# EAGLE design 555Oscillator (EAGLE 9.1.3)
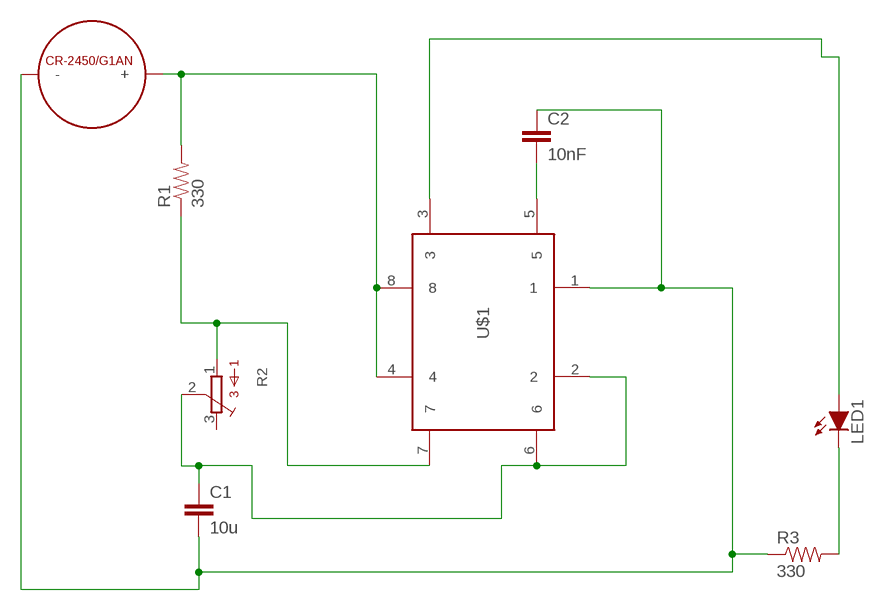
[diagram p0: schematic, sheet 1]

## Parts
C1  10u  CAP_  [AXIAL-5MM]
C2  10nF  CAP_  [AXIAL-5MM]
LED1  LED-5MM  [LED-5MM]
R1  330  RESISTORAXIAL-0.3  [AXIAL-0.3]
R2  TRIMPOT_3296C  [TRIMPOT_3296]
R3  330  RESISTORAXIAL-0.3  [AXIAL-0.3]
U$1  555_TIMER  [DIL08]
U$2  CR-2450/G1AN  [CR-2450/G1AN]

## Nets
N$2: C1.P$2 C2.P$1 R3.P$1 U$1.1 U$2.-
N$3: R1.P$1 R2.1 U$1.7
N$8: R1.P$2 U$1.4 U$1.8 U$2.+_0(+) U$2.+_1(+)
N$9: LED1.A U$1.3
N$10: LED1.K(C) R3.P$2
N$11: C2.P$2 U$1.5
N$13: C1.P$1 R2.2 U$1.2 U$1.6
Unconnected: R2.3

## Library data of the parts
C1 C2 = HyTechDevices:CAP: Capacitor Standard 0603 ceramic capacitor, and 0.1" leaded capacitor.
LED1 = HyTechDevices:LED: Light Emitting Diode (LED) Source: Dangerous Prototypes Eagle Library <https://github.com/DangerousPrototypes/Eagle_Part_Library>
R1 R3 = HyTechDevices:RESISTOR: Resistor Basic schematic elements and footprints for 0603, 1206, and PTH resistors.
R2 = HyTechDevices:TRIMPOT_3296: 3296 Series 3/8" Square Trimmer Source <https://github.com/chiengineer/Eagle-Libraries/blob/master/Potentiometers/bourns.lbr>
U$1 = HyTechDevices:555_TIMER: Standard 555 Timer Fairchild Semiconductor LM555CN Texas Instruments LM555CN/NOPB
U$2 = HyTechDevices:CR-2450/G1AN: Panasonic CR2450 Battery through hole.

## Board
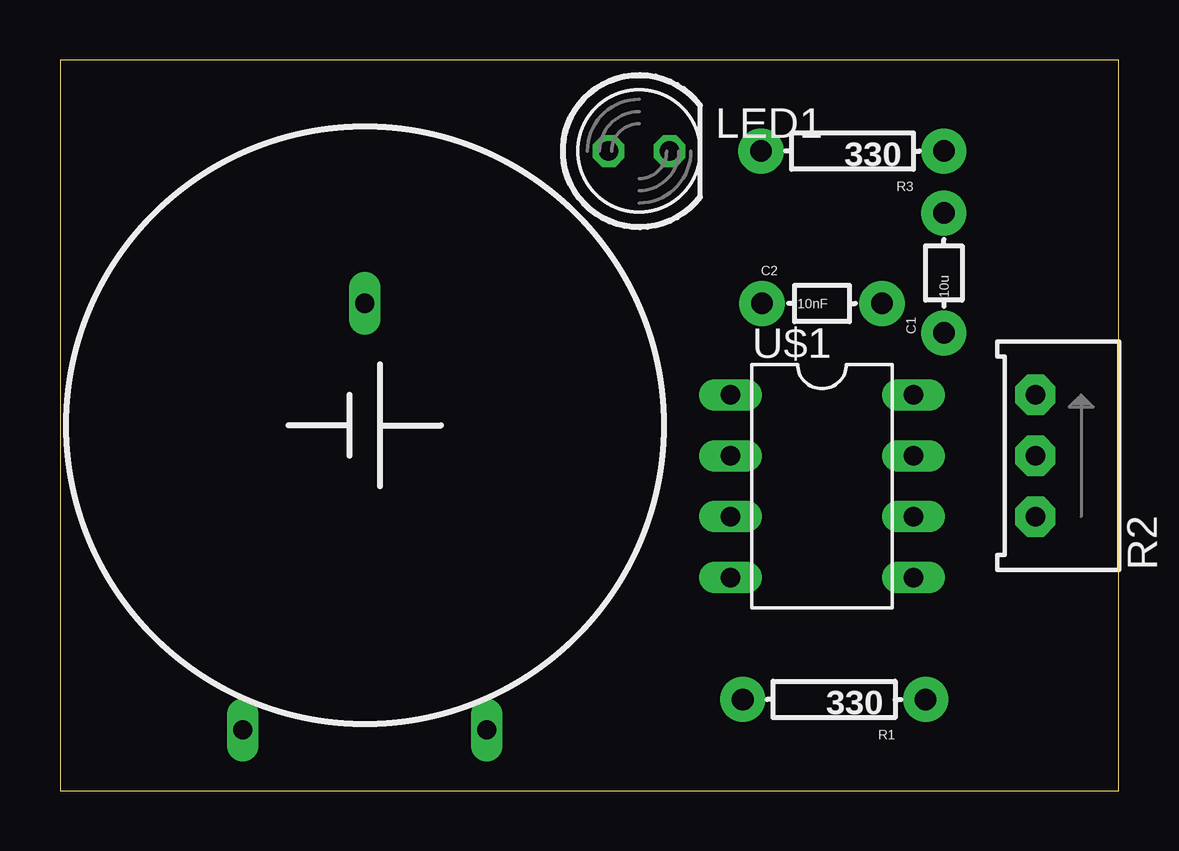
[diagram p1: board, top side]
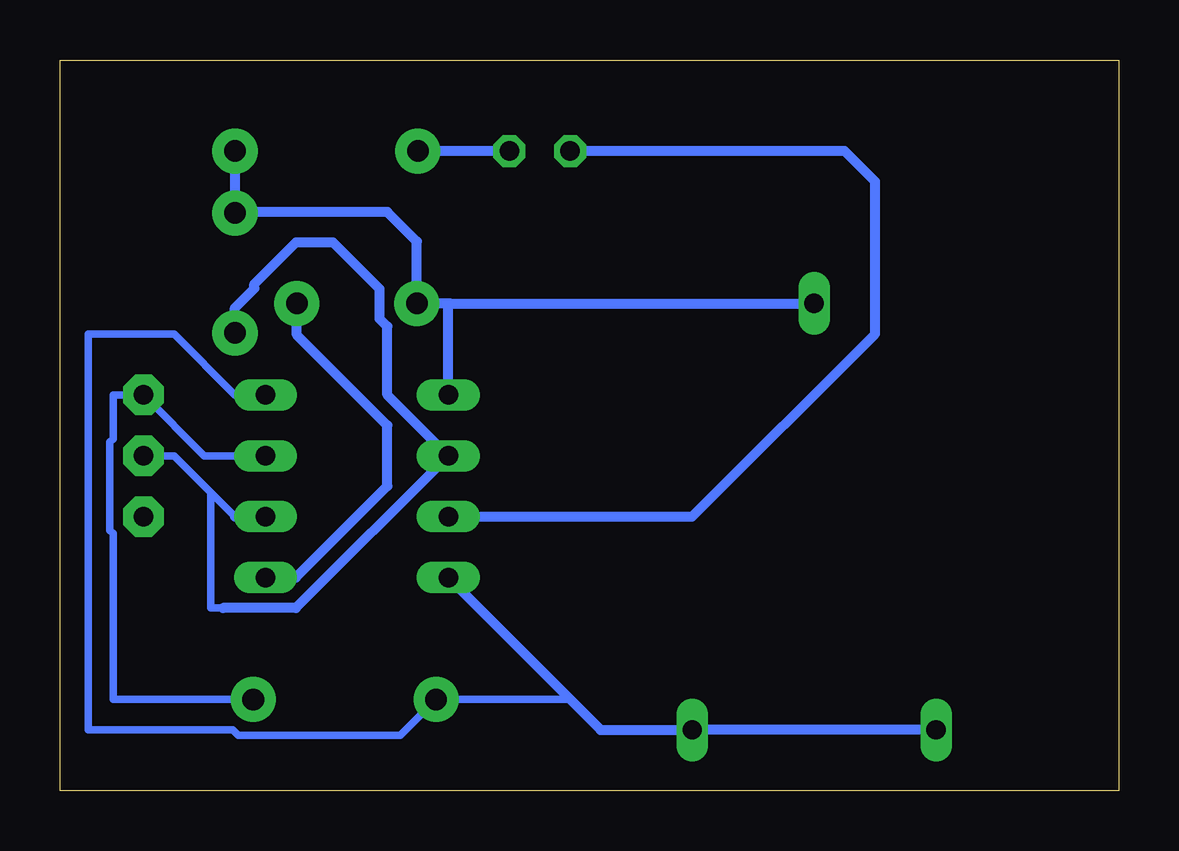
[diagram p2: board, bottom side, seen from below]

Size 44.12 x 30.47 mm. Coordinates in mm from the lower left corner, seen from the top.
Outline: 0,0 44.12,0 44.12,30.47 0,30.47 0,0
Copper layers (1*16): Top 0.035mm / dielectric 1.5mm / Bottom 0.035mm
Design rules "default *": minimum track width 6mil, minimum drill 0.35mm, track to track 16mil, track to pad 16mil, pad to pad 16mil, via to via 16mil, smd to smd 16mil, copper to edge 40mil, drill to drill 6mil, minimum pad ring 10mil, minimum via ring 8mil, stop-mask expansion 4mil, vias tented up to drill 0mil, thermal gap 10mil

### Footprints (pad centres in the part's own frame; a part is rotated, then mirrored left to right if it is on the bottom)
AXIAL-5MM = drill 0.9 pad 1.88: P$1 -2.5,0; P$2 2.5,0
LED-5MM = drill 0.813 octagon: A -1.27,0; K 1.27,0
AXIAL-0.3 = drill 0.9 pad 1.88: P$1 -3.81,0; P$2 3.81,0
TRIMPOT_3296 = drill 0.813 pad 1.676 octagon: 1 2.54,1.27; 2 0,1.27; 3 -2.54,1.27
DIL08 = drill 0.813 long: 1 -3.81,-3.81; 2 -1.27,-3.81; 3 1.27,-3.81; 4 3.81,-3.81; 5 3.81,3.81; 6 1.27,3.81; 7 -1.27,3.81; 8 -3.81,3.81
CR-2450/G1AN = drill 0.8 long: +_0 -5.08,12.7; +_1 5.08,12.7; - 0,-5.08

### Placement (x,y rotation side)
C1  36.83,21.59 90 top
C2  31.75,20.32 0 top
LED1  24.13,26.67 0 top
R1  32.26,3.81 180 top
R2  41.91,13.97 90 top
R3  33.02,26.67 180 top
U$1  31.75,12.7 270 top
U$2  12.7,15.24 180 top

### Tracks (layer width: path | path; a pad name or v marks a point on that pad's centre or on a via)
N$2
  Bottom 0.406: 27.88,20.32 U$2.- | 27.88,20.32 C2.P$1 29.25,22.9 30.48,24.13 36.79,24.13 C1.P$2 R3.P$1 | U$1.1 27.94,20.26 27.88,20.32
N$3
  Bottom 0.305: U$1.7 38.1,13.97 R2.1 41.91,16.51 41.91,14.68 42.04,14.55 42.04,10.85 41.91,10.72 41.91,3.81 R1.P$1
N$8
  Bottom 0.305: 22.81,3.76 22.81,3.81 R1.P$2 29.95,2.31 36.69,2.31 36.92,2.54 42.95,2.54 42.95,19.05 39.37,19.05 36.83,16.51 U$1.8
  Bottom 0.406: U$2.+_1 U$2.+_0 21.59,2.54 22.81,3.76 U$1.4
N$9
  Bottom 0.406: U$1.3 17.78,11.43 10.16,19.05 10.16,25.4 11.43,26.67 LED1.A
N$10
  Bottom 0.406: LED1.K R3.P$2
N$11
  Bottom 0.406: C2.P$2 34.25,19.01 30.48,15.24 30.48,12.7 34.29,8.89 U$1.5
N$13
  Bottom 0.305: R2.2 39.37,13.97 37.84,12.45 | 37.84,12.45 36.83,11.43 | 37.34,7.62 37.84,7.62 37.84,12.45
  Bottom 0.406: 36.83,11.43 U$1.6 | C1.P$1 36.83,20.13 36.02,20.95 36.02,21.13 34.29,22.86 32.74,22.86 30.8,20.92 30.8,19.68 30.48,19.36 30.48,16.51 U$1.2 34.29,7.62 37.34,7.62